# EAGLE design tm7_revB (EAGLE 9.6.2)
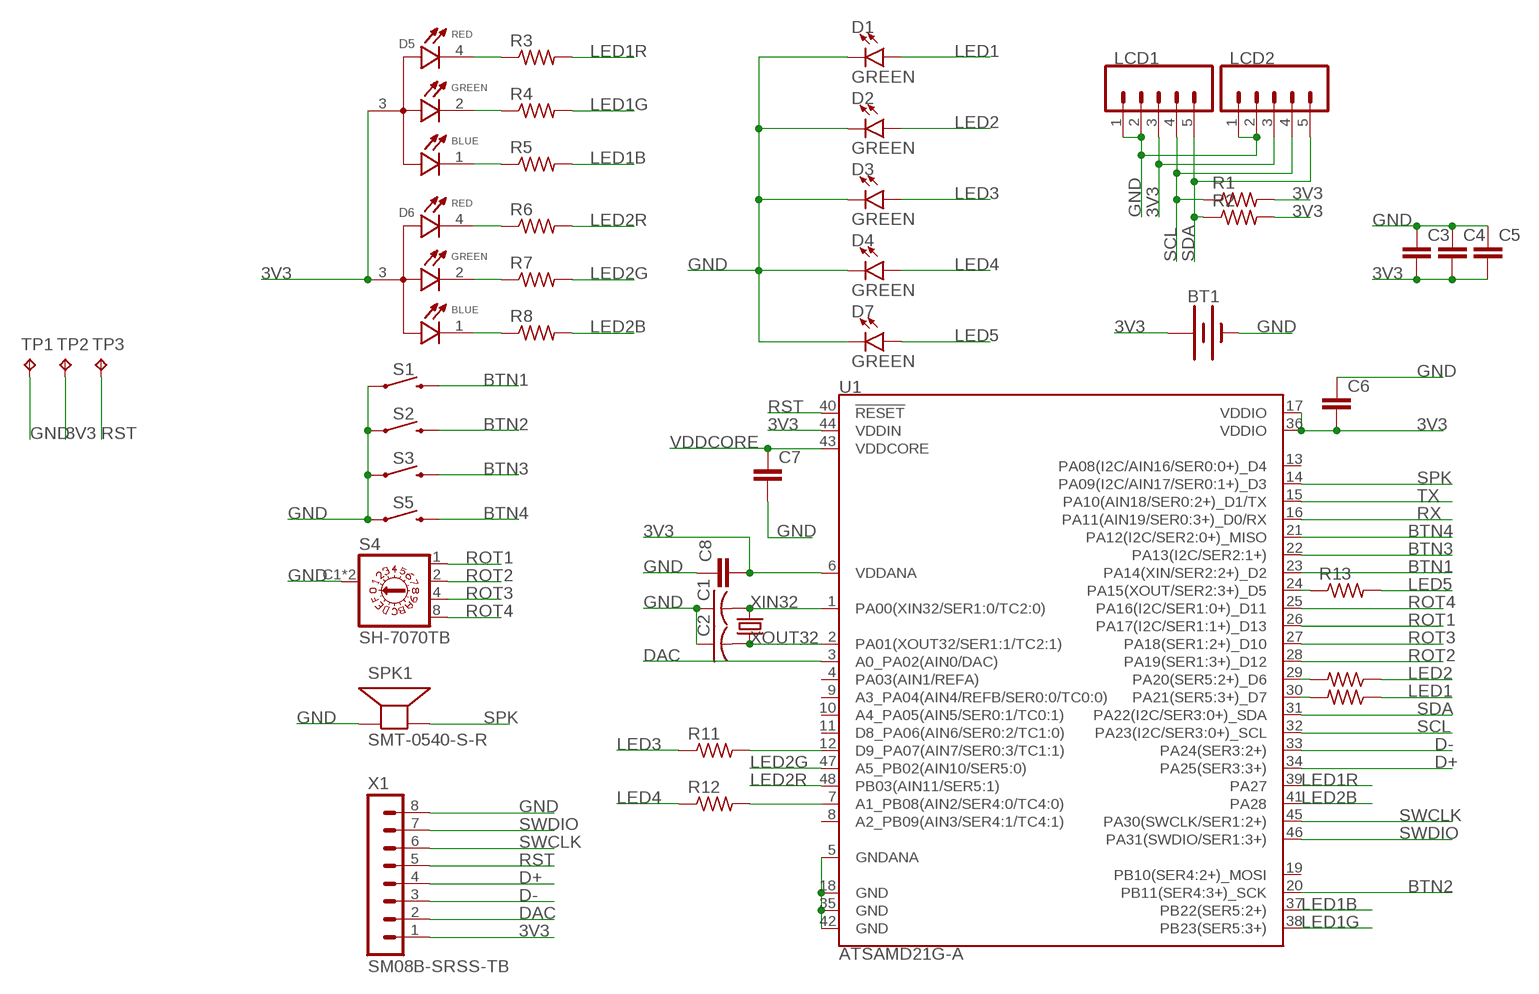
[diagram p0: schematic, sheet 1]

## Parts
BT1  BATTERY-20MM_SMD_4LEGS_OVERPASTE_INNER  [BATTCON_20MM_4LEGS_OVERPASTE_INNER]
C1  C-USC0603  [C0603]
C2  C-USC0603  [C0603]
C3  C-EUC0603  [C0603]
C4  C-EUC0603  [C0603]
C5  C-EUC0603  [C0603]
C6  C-EUC0603  [C0603]
C7  C-EUC0603  [C0603]
C8  C-EUC0603  [C0603]
D1  GREEN  LED-GREEN1206  [LED-1206]
D2  GREEN  LED-GREEN1206  [LED-1206]
D3  GREEN  LED-GREEN1206  [LED-1206]
D4  GREEN  LED-GREEN1206  [LED-1206]
D5  EAST1616RGBA3  [LED_EAST1616RGBA3]
D6  EAST1616RGBA3  [LED_EAST1616RGBA3]
D7  GREEN  LED-GREEN1206  [LED-1206]
LCD1  CONN_05VERT_FEMALE_HEADER  [1X05_SMD_VERTICAL_COMBO]
LCD2  CONN_05VERT_FEMALE_HEADER  [1X05_SMD_VERTICAL_COMBO]
R1  R-US_R0603  [R0603]
R2  R-US_R0603  [R0603]
R3  R-US_R0603  [R0603]
R4  R-US_R0603  [R0603]
R5  R-US_R0603  [R0603]
R6  R-US_R0603  [R0603]
R7  R-US_R0603  [R0603]
R8  R-US_R0603  [R0603]
R9  R-US_R0603  [R0603]
R10  R-US_R0603  [R0603]
R11  R-US_R0603  [R0603]
R12  R-US_R0603  [R0603]
R13  R-US_R0603  [R0603]
S1  MOMENTARY-SWITCH-SPST-SMD-6.0X3.5MM  [TACTILE_SWITCH_SMD_6.0X3.5MM]
S2  MOMENTARY-SWITCH-SPST-SMD-6.0X3.5MM  [TACTILE_SWITCH_SMD_6.0X3.5MM]
S3  MOMENTARY-SWITCH-SPST-SMD-6.0X3.5MM  [TACTILE_SWITCH_SMD_6.0X3.5MM]
S4  SH-7070TB  [SH-7070B]
S5  MOMENTARY-SWITCH-SPST-SMD-6.0X3.5MM  [TACTILE_SWITCH_SMD_6.0X3.5MM]
SPK1  SMT-0540-S-R  [SMT-0540-S-R]
TP1  TPTP12R  [TP12R]
TP2  TPTP12R  [TP12R]
TP3  TPTP12R  [TP12R]
U1  ATSAMD21G-A  [TQFP-48]
X1  SM08B-SRSS-TB  [SM08B-SRSS-TB]
Y1  32.768kHz  CRYSTAL-32.768KHZSMD-3.2X1.5  [CRYSTAL-SMD-3.2X1.5MM]

## Nets
3V3: BT1.1(+) C3.2 C4.2 C5.2 C6.2 C8.2 D5.3(A) D6.3(A) LCD1.3 LCD2.3 R1.2 R2.2 TP2.TP U1.6(VDDANA) U1.17(VDDIO) U1.36(VDDIO) U1.44(VDDIN) X1.1
BTN1: S1.2 U1.23(PA14(XIN/SER2:2+)_D2)
BTN2: S2.2 U1.20(PB11(SER4:3+)_SCK)
BTN3: S3.2 U1.22(PA13(I2C/SER2:1+))
BTN4: S5.2 U1.21(PA12(I2C/SER2:0+)_MISO)
D+: U1.34(PA25(SER3:3+)) X1.4
D-: U1.33(PA24(SER3:2+)) X1.3
DAC: U1.3(A0_PA02(AIN0/DAC)) X1.2
GND: BT1.2(-) C1.1 C2.1 C3.1 C4.1 C5.1 C6.1 C7.2 C8.1 D1.C D2.C D3.C D4.C D7.C LCD1.1 LCD1.2 LCD2.1 LCD2.2 S1.1 S2.1 S3.1 S4.C1(C) S4.C2(C) S5.1 SPK1.-(+) TP1.TP U1.5(GNDANA) U1.18(GND) U1.35(GND) U1.42(GND) X1.8
LED1: D1.A R9.1
LED1B: R5.2 U1.37(PB22(SER5:2+))
LED1G: R4.2 U1.38(PB23(SER5:3+))
LED1R: R3.2 U1.39(PA27)
LED2: D2.A R10.1
LED2B: R8.2 U1.41(PA28)
LED2G: R7.2 U1.47(A5_PB02(AIN10/SER5:0))
LED2R: R6.2 U1.48(PB03(AIN11/SER5:1))
LED3: D3.A R11.1
LED4: D4.A R12.1
LED5: D7.A R13.2
N$1: R12.2 U1.7(A1_PB08(AIN2/SER4:0/TC4:0))
N$2: R11.2 U1.12(D9_PA07(AIN7/SER0:3/TC1:1))
N$3: R9.2 U1.30(PA21(SER5:3+)_D7)
N$4: R10.2 U1.29(PA20(SER5:2+)_D6)
N$5: D5.4(R_C) R3.1
N$6: D5.2(G_C) R4.1
N$7: D5.1(B_C) R5.1
N$8: D6.4(R_C) R6.1
N$9: D6.2(G_C) R7.1
N$10: D6.1(B_C) R8.1
N$11: R13.1 U1.24(PA15(XOUT/SER2:3+)_D5)
ROT1: S4.1 U1.26(PA17(I2C/SER1:1+)_D13)
ROT2: S4.2 U1.28(PA19(SER1:3+)_D12)
ROT3: S4.4 U1.27(PA18(SER1:2+)_D10)
ROT4: S4.8 U1.25(PA16(I2C/SER1:0+)_D11)
RST: TP3.TP U1.40(!RESET!) X1.5
RX: U1.16(PA11(AIN19/SER0:3+)_D0/RX)
SCL: LCD1.4 LCD2.4 R1.1 U1.32(PA23(I2C/SER3:0+)_SCL)
SDA: LCD1.5 LCD2.5 R2.1 U1.31(PA22(I2C/SER3:0+)_SDA)
SPK: SPK1.+(-) U1.14(PA09(I2C/AIN17/SER0:1+)_D3)
SWCLK: U1.45(PA30(SWCLK/SER1:2+)) X1.6
SWDIO: U1.46(PA31(SWDIO/SER1:3+)) X1.7
TX: U1.15(PA10(AIN18/SER0:2+)_D1/TX)
VDDCORE: C7.1 U1.43(VDDCORE)
XIN32: C1.2 U1.1(PA00(XIN32/SER1:0/TC2:0)) Y1.P$2
XOUT32: C2.2 U1.2(PA01(XOUT32/SER1:1/TC2:1)) Y1.P$1
Unconnected: U1.4(PA03(AIN1/REFA)) U1.8(A2_PB09(AIN3/SER4:1/TC4:1)) U1.9(A3_PA04(AIN4/REFB/SER0:0/TC0:0)) U1.10(A4_PA05(AIN5/SER0:1/TC0:1)) U1.11(D8_PA06(AIN6/SER0:2/TC1:0)) U1.13(PA08(I2C/AIN16/SER0:0+)_D4) U1.19(PB10(SER4:2+)_MOSI)

## Library data of the parts
BT1 = SparkFun-Batteries:BATTERY: Battery - Single Cell A variety of battery chemistries, sizes, and footprints. Device List: 20MM_PTH - Coin Cell Battery Holder - 20mm (PTH) <https://www.sparkfun.com/products/783> 20MM_PTH_KIT- Coin Cell battery Holder - 20 mm (PTH) <http://www.sparkfun.com/products/783>kit version with special mask 6.8MM_PTH - Coin Cell Battery Holder - 6.8MM(SMD) <https://www.digikey.com/product-detail/en/seiko-instruments/MS621FE-FL11E/728-1057-ND/1889208?WT.srch=1&gclid=CNOQ5a6LzdQCFZS2wAodXCkE0g> 12MM_SMD - Coin Cell Battery Holder - 12mm (SMD) <https://www.sparkfun.com/products/10592> 12MM_PTH - Coin Cell Battery Holder - 12mm (PTH) <https://www.sparkfun.com/products/7948> 20MM_SMD - 20mm Coin Cell Battery Holder (SMD) (2 legs) Used on the Big Time Watch Kit <https://www.sparkfun.com/products/11734> 20MM_SMD_4LEGS - Coin Cell Battery Holder - 20mm (SMD) <https://www.sparkfun.com/products/11892> 20MM_SMD_4LEGS_OVERPASTE - Coin Cell Battery Holder - 20mm (SMD) <https://www.sparkfun.com/products/11892> (Over-paste on the legs) 24.5MM_PTH - Coin Cell Battery Holder - 24.5mm (PTH) <https://www.sparkfun.com/products/8863> 9V - 9V Battery Holder - PC Mount Used on the SparkFun SparkPunk Sound Kit <https://www.sparkfun.com/products/11177> and SparkFun SparkPunk Sequencer Kit <https://www.sparkfun.com/products/12707> 18650 - Battery Holder - 18650 (PTH) <https://www.sparkfun.com/products/13113> AA - Battery Holder - 1xAA (PTH) <https://www.sparkfun.com/products/7949> AAA - Battery Holder - 1xAAA (PTH) <https://www.sparkfun.com/products/12718> AA_KIT - Battery Holder - 1xAA (PTH) <https://www.sparkfun.com/products/7949> Special kit package - pads only have exposed copper on one side of the board. AAA_KIT - Battery Holder - 1xAAA (PTH) <https://www.sparkfun.com/products/12718> Special kit package - pads only have exposed copper on one side of the board.
C1 C2 = adafruit:C-US: CAPACITOR, American symbol
C3-C8 = rcl:C-EU: CAPACITOR, European symbol; SPICEPREFIX: C
D1-D4 D7 = SparkFun-LED:LED-GREEN: Green SMD LED Used in manufacturing of various products at SparkFun Packages: 0603 - SMD 0603 package [Product Link] <http://www.futureelectronics.com/en/technologies/semiconductors/optoelectronics/leds/Pages/9894312-LTST-C190GKT.aspx?CrossPart=HSMG-C190&IM=0> LilyPad 1206 - SMD1206 LilyPad package [Product Link] <http://www.futureelectronics.com/en/Technologies/Product.aspx?ProductID=IN150NGHARVATEKCORPORATION2049943&IM=0> 1206 - SMD1206 package [Product Link] <http://www.futureelectronics.com/en/technologies/semiconductors/optoelectronics/leds/Pages/8315665-LTST-C150KGKT.aspx?IM=0> 1206 Bottom Mount -SMD 1206 Bottom Mount [Product Link] <http://www.digikey.com/product-detail/en/lite-on-inc/LTST-C230KGKT/160-1456-1-ND/386854> SparkFun Products: Pro Mini 328 -5V <https://www.sparkfun.com/products/821> RedBoard <https://www.sparkfun.com/products/12757> MP3 Trigger <https://www.sparkfun.com/products/13720> Makey Makey <https://www.sparkfun.com/products/11076>; PROD_ID: DIO-00862
D5 D6 = EAST1616RGBA3:EAST1616RGBA3: Red, Green, Blue (RGB) LED Indication - Discrete 1.95V Red, 2.8V Green, 2.8V Blue 0606 (1616 Metric) Check availability <https://pricing.snapeda.com/parts/EAST1616RGBA3/Everlight%20Electronics/view-part?ref=eda>; AVAILABILITY: In Stock; DESCRIPTION: Red, Green, Blue (RGB) - LED Indication - Discrete 1.95V Red, 2.8V Green, 2.8V Blue 0606 (1616 Metric); MF: Everlight Electronics; MP: EAST1616RGBA3; PACKAGE: 0606 Everlight; PRICE: None; PURCHASE-URL: https://pricing.snapeda.com/search/part/EAST1616RGBA3/?ref=eda
LCD1 LCD2 = SparkFun-Connectors:CONN_05: Multi connection point. Often used as Generic Header-pin footprint for 0.1 inch spaced/style header connections On any of the 0.1 inch spaced packages, you can populate with these: Break Away Headers - Straight <https://www.sparkfun.com/products/116> (PRT-00116) Break Away Male Headers - Right Angle <https://www.sparkfun.com/products/553> (PRT-00553) Female Headers <https://www.sparkfun.com/products/115> (PRT-00115) Break Away Headers - Machine Pin <https://www.sparkfun.com/products/117> (PRT-00117) Break Away Female Headers - Swiss Machine Pin <https://www.sparkfun.com/products/743> (PRT-00743) For SCREWTERMINALS and SPRING TERMINALS visit here: Screw Terimnals on SparkFun.com <https://www.sparkfun.com/search/results?term=Screw+Terminals> (5mm/3.5mm/2.54mm spacing) This device is also useful as a general connection point to wire up your design to another part of your project. Our various solder wires solder well into these plated through hole pads. Hook-Up Wire - Assortment (Stranded, 22 AWG) <https://www.sparkfun.com/products/11375> (PRT-11375) Hook-Up Wire - Assortment (Solid Core, 22 AWG) <https://www.sparkfun.com/products/11367> (PRT-11367) View the entire wire category on our website here <https://www.sparkfun.com/categories/141> Special notes: Molex polarized connector foot print use with SKU : PRT-08231 with associated crimp pins and housings. 1MM SMD Version SKU: PRT-10208; PROD_ID: CONN-15262
R1-R13 = rcl:R-US_: RESISTOR, American symbol; SPICEPREFIX: R
S1-S3 S5 = SparkFun-Switches:MOMENTARY-SWITCH-SPST: Momentary Switch (Pushbutton) - SPST Normally-open (NO) SPST momentary switches (buttons, pushbuttons). Variants PTH-12MM - 12mm square, through-hole Momentary Pushbutton Switch - 12mm Square <https://www.sparkfun.com/products/9190> (COM-09190) PTH-6.0MM, PTH-6.0MM-KIT - 6.0mm square, through-hole Mini Pushbutton Switch <https://www.sparkfun.com/products/97> (COM-00097) KIT package intended for soldering kit's - only one side of pads' copper is exposed. PTH-RIGHT-ANGLE-KIT - Right-angle, through-hole Right Angle Tactile Button <https://www.sparkfun.com/products/10791> - Used on SparkFun BigTime Watch Kit <https://www.sparkfun.com/products/11734> SMD-12MM - 12mm square, surface-mount Tactile Button - SMD (12mm) <https://www.sparkfun.com/products/12993> (COM-12993) Used on SparkFun PicoBoard <https://www.sparkfun.com/products/11888> SMD-4.5MM - 4.5mm Square Trackball Switch Used on SparkFun Blackberry Trackballer Breakout <https://www.sparkfun.com/products/13169> SMD-4.6MMX2.8MM - 4.60mm x 2.80mm, surface mount Used on SparkFun Pro Micro - RP2040 <https://www.sparkfun.com/products/17717> SMD-5.2MM, SMD-5.2-REDUNDANT - 5.2mm square, surface-mount Mini Pushbutton Switch - SMD <https://www.sparkfun.com/products/8720> (COM-08720) Used on Arduino Pro Mini <https://www.sparkfun.com/products/11114> REDUNDANT package connects both switch circuits together SMD-6.0X3.5MM - 6.0 x 3.5mm, surface mount Momentary Reset Switch SMD <https://www.sparkfun.com/products/8229> (COM-08229) SMD-6.2MM-TALL - 6.2mm square, surface mount Tactile Button - SMD (6mm) <https://www.sparkfun.com/products/12992> Used on SparkFun Digital Sandbox <https://www.sparkfun.com/products/12651> SMD-RIGHT-ANGLE - Right-angle, surface mount Used on SparkFun Block for Intel® Edison - Arduino <https://www.sparkfun.com/products/13036>; PROD_ID: SWCH-14278; SF_SKU: COM-08229
S4 = SH-7070TB:SH-7070TB: ROTARY CODED HEX SWITCH Check availability <https://pricing.snapeda.com/parts/SH-7070TB/Nidec%20Copal/view-part?ref=eda>; AVAILABILITY: In Stock; DESCRIPTION: Dip Switch Hexadecimal Complement 16 Position Surface Mount Rotary for Tool Actuator 100mA 5VDC; MF: Nidec Copal; MP: SH-7070TB; PACKAGE: None; PRICE: None; PURCHASE-URL: https://pricing.snapeda.com/search/part/SH-7070TB/?ref=eda
SPK1 = SMT-0540-S-R:SMT-0540-S-R: SMT-0549-S-R Small surface-mount magnetic buzzer Check availability <https://pricing.snapeda.com/parts/SMT-0540-S-R/PUI/view-part?ref=eda>; AVAILABILITY: In Stock; DESCRIPTION: SURFACE MOUNT TRANSDUCER 3V0-P 100MA; MF: PUI; MP: SMT-0540-S-R; PACKAGE: None; PRICE: None; PURCHASE-URL: https://pricing.snapeda.com/search/part/SMT-0540-S-R/?ref=eda
TP1-TP3 = testpad:TP: Test pad
U1 = SparkFun-IC-Microcontroller:ATSAMD21G: Atmel SAMD21G SMART ARM-Based Microcontroller The Atmel ® | SMART ™ SAM D21 is a series of low-power microcontrollers using the 32-bit ARM ® Cortex ® -M0+ processor, and ranging from 32- to 64-pins with up to 256KB Flash and 32KB of SRAM. The SAM D21 devices operate at a maximum frequency of 48MHz and reach 2.46 CoreMark/MHz. They are designed for simple and intuitive migration with identical peripheral modules, hex compatible code, identical linear address map and pin compatible migration paths between all devices in the product series. All devices include intelligent and flexible peripherals, Atmel Event System for inter-peripheral signaling, and support for capacitive touch button, slider and wheel user interfaces. Datasheet <https://cdn.sparkfun.com/datasheets/Dev/Arduino/Boards/Atmel-42181-SAM-D21_Datasheet.pdf> SparkFun Products SparkFun SAMD21 Mini Breakout <https://www.sparkfun.com/products/13664> (DEV-13664) SparkFun SAMD21 Dev Breakout <https://www.sparkfun.com/products/13672> (DEV-13672) (DEV-14926); PROD_ID: IC-13064
X1 = con-JST:SM08B-SRSS: JST SH series header 1.00mm pitch disconnectable crimp style connectors, horizontal (side entry type), 8 pins
Y1 = SparkFun-Clocks:CRYSTAL-32.768KHZ: 32.768kHz Crystal Frequency: 32.768kHz Frequency Stability: ±20ppm Load Capacitance: 12.5pF (PTH-2X6 & SMD-3.2X1.5), 6pF (SMD-2X6) SparkFun Products: SparkFun BigTime Watch Kit <https://www.sparkfun.com/products/11734> SparkFun nRF52832 Breakout <https://www.sparkfun.com/products/13990> SparkFun Real Time Clock Module <https://www.sparkfun.com/products/12708>; PROD_ID: XTAL-13062

## Board
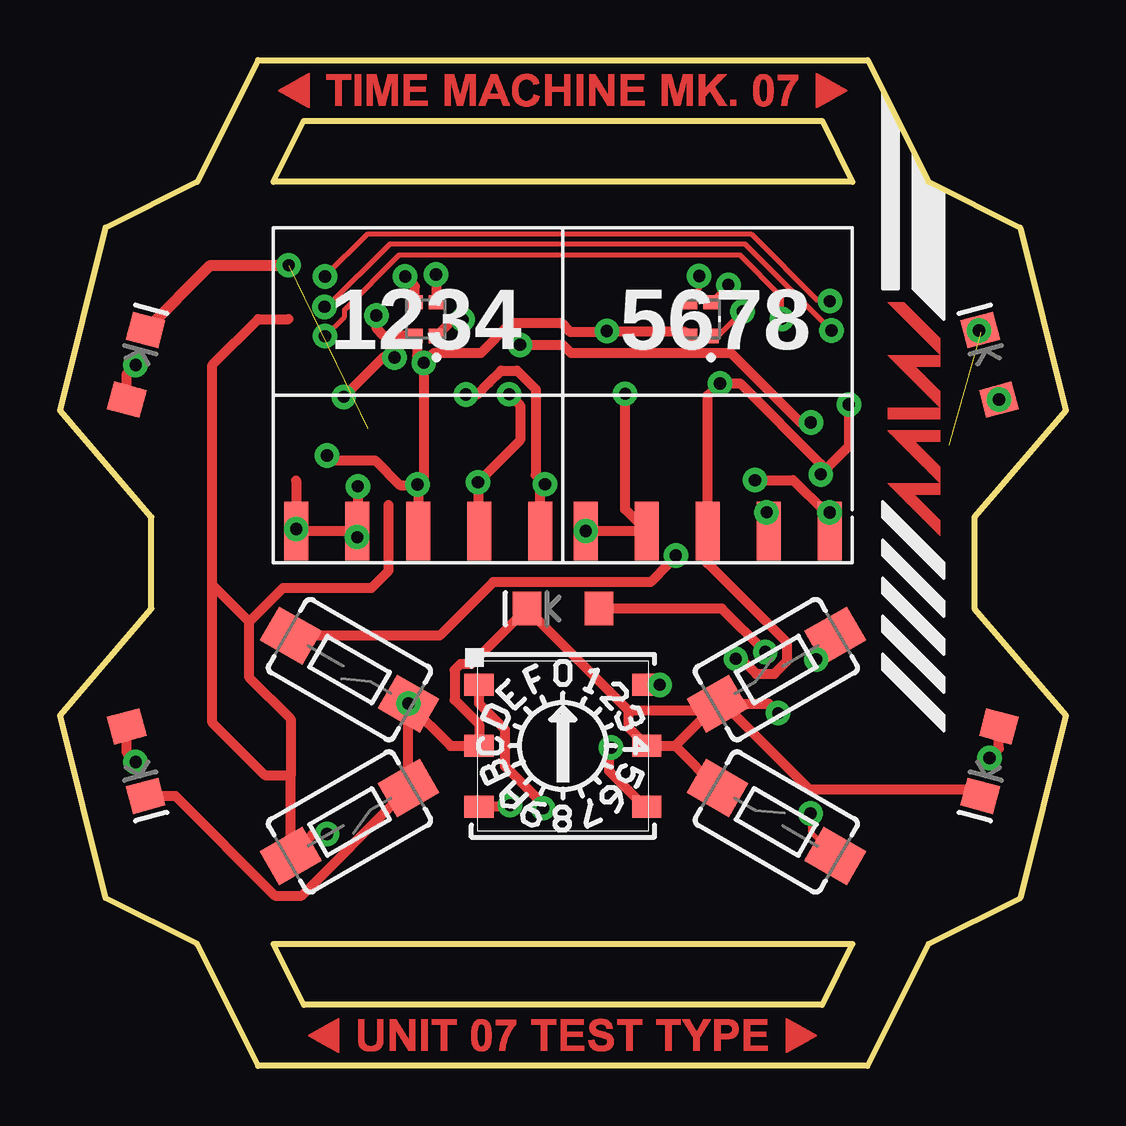
[diagram p1: board, top side]
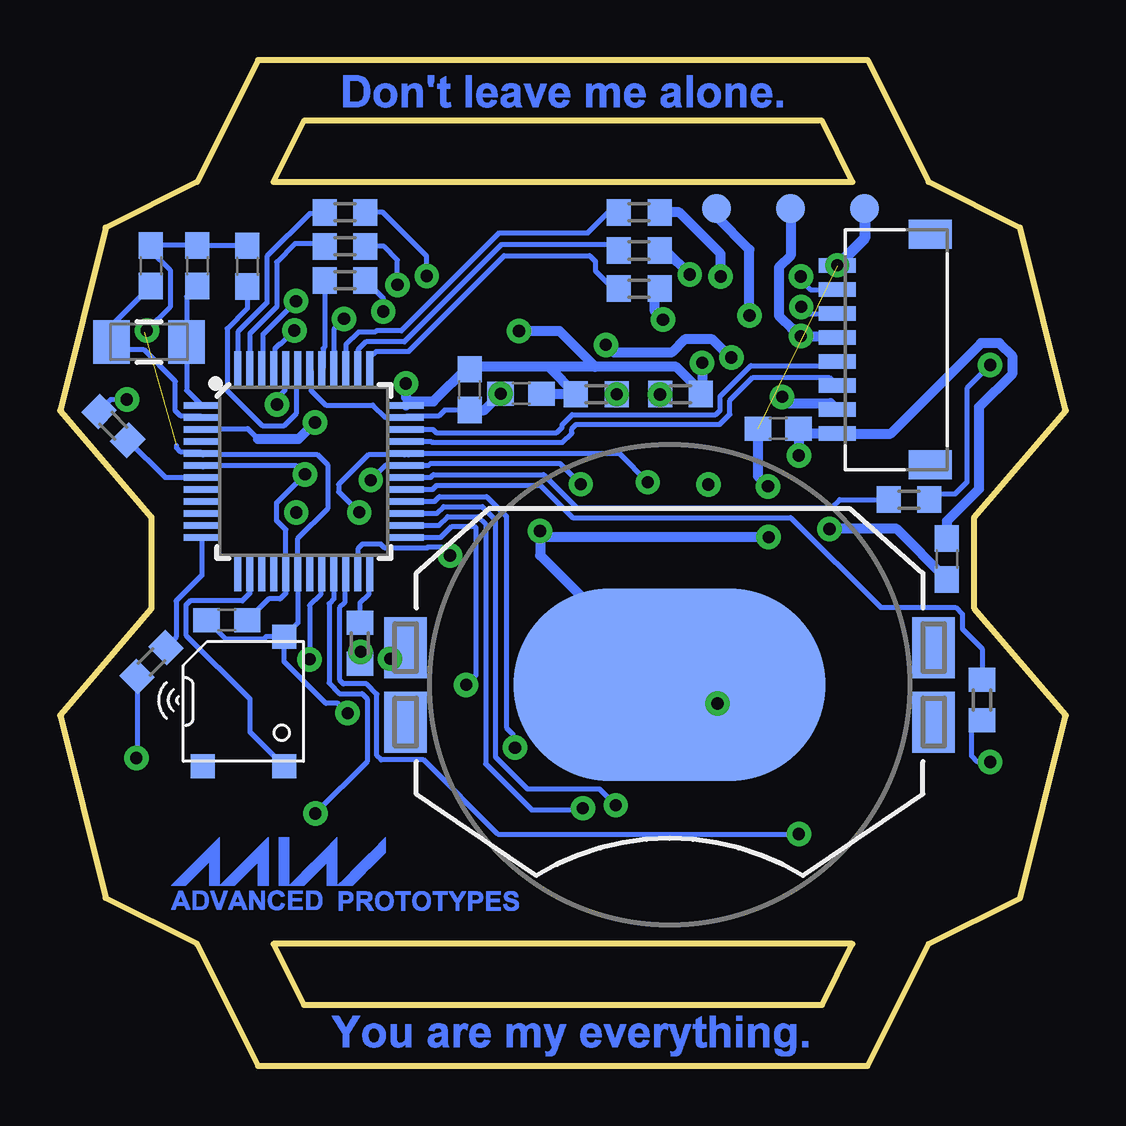
[diagram p2: board, bottom side, seen from below]

Size 41.91 x 41.91 mm. Coordinates in mm from the lower left corner, seen from the top.
Outline: 33.66,0 8.25,0 5.71,5.08 1.9,6.98 0,14.61 3.81,19.05 3.81,22.86 0,27.3 1.9,34.92 5.71,36.83 8.25,41.91 33.66,41.91 36.19,36.83 40,34.92 41.91,27.3 38.1,22.86 38.1,19.05 41.91,14.61 40,6.98 36.19,5.08 33.66,0
Outline: 8.89,36.83 10.16,39.37 31.75,39.37 33.02,36.83 8.89,36.83
Outline: 33.02,5.08 31.75,2.54 10.16,2.54 8.89,5.08 33.02,5.08
Copper layers (1*16): Top 0.035mm / dielectric 1.5mm / Bottom 0.035mm
Design rules "SparkFun": minimum track width 8mil, minimum drill 20mil, track to track 8mil, track to pad 8mil, pad to pad 8mil, via to via 8mil, smd to smd 8mil, copper to edge 10mil, drill to drill 8mil, minimum pad ring 12mil, minimum via ring 10mil, stop-mask expansion 4mil, vias tented up to drill 25mil, thermal gap 10mil

### Footprints (pad centres in the part's own frame; a part is rotated, then mirrored left to right if it is on the bottom)
BATTCON_20MM_4LEGS_OVERPASTE_INNER = smd 1.778 x 2.54: 1 -11,1.55; 3 11,1.55; P$1 -11,-1.55; P$2 11,-1.55 | smd 13 x 8: 2 0,0
C0603 = smd 1.1 x 1: 1 -0.85,0; 2 0.85,0
LED-1206 = smd 1.2 x 1.4: A -1.5,0; C 1.5,0
LED_EAST1616RGBA3 = smd 0.6 x 0.65: 1 0.7,0.45; 2 -0.7,0.45; 3 0.7,-0.45; 4 -0.7,-0.45
1X05_SMD_VERTICAL_COMBO = smd 1 x 2.438: 1 0,1.65; 2 2.54,1.65; 3 5.08,1.65; 4 7.62,1.652; 5 10.16,1.65
R0603 = smd 1 x 1.1: 1 -0.85,0; 2 0.85,0
TACTILE_SWITCH_SMD_6.0X3.5MM = smd 2.032 x 1.626: 1 -2.833,0; 2 2.833,0
SH-7070B = smd 1.219 x 0.914: 1 -2.223,3.81; 2 4.763,-1.27; 4 -2.223,-1.27; 8 4.763,3.81; C1 -2.223,1.27; C2 4.763,1.27
SMT-0540-S-R = smd 1 x 1: + 1.7,-2.7; - 1.7,2.7; M -1.7,-2.7
TP12R = smd 1.2 x 1.2: TP 0,0
TQFP-48 = smd 1.5 x 0.28: 1 -4.25,2.75; 2 -4.25,2.25; 3 -4.25,1.75; 4 -4.25,1.25; 5 -4.25,0.75; 6 -4.25,0.25; 7 -4.25,-0.25; 8 -4.25,-0.75; 9 -4.25,-1.25; 10 -4.25,-1.75; 11 -4.25,-2.25; 12 -4.25,-2.75; 25 4.25,-2.75; 26 4.25,-2.25; 27 4.25,-1.75; 28 4.25,-1.25; 29 4.25,-0.75; 30 4.25,-0.25; 31 4.25,0.25; 32 4.25,0.75; 33 4.25,1.25; 34 4.25,1.75; 35 4.25,2.25; 36 4.25,2.75 | smd 0.28 x 1.5: 13 -2.75,-4.25; 14 -2.25,-4.25; 15 -1.75,-4.25; 16 -1.25,-4.25; 17 -0.75,-4.25; 18 -0.25,-4.25; 19 0.25,-4.25; 20 0.75,-4.25; 21 1.25,-4.25; 22 1.75,-4.25; 23 2.25,-4.25; 24 2.75,-4.25; 37 2.75,4.25; 38 2.25,4.25; 39 1.75,4.25; 40 1.25,4.25; 41 0.75,4.25; 42 0.25,4.25; 43 -0.25,4.25; 44 -0.75,4.25; 45 -1.25,4.25; 46 -1.75,4.25; 47 -2.25,4.25; 48 -2.75,4.25
SM08B-SRSS-TB = smd 0.6 x 1.55: 1 3.5,0; 2 2.5,0; 3 1.5,0; 4 0.5,0; 5 -0.5,0; 6 -1.5,0; 7 -2.5,0; 8 -3.5,0 | smd 1.2 x 1.8: M1 4.8,3.875; M2 -4.8,3.875
CRYSTAL-SMD-3.2X1.5MM = smd 1.524 x 1.8: P$1 -1.567,0; P$2 1.567,0

### Placement (x,y rotation side)
BT1  16.51,15.88 0 bottom
C1  36.19,33.34 270 bottom
C2  38.13,33.34 270 bottom
C3  4.95,21.12 90 bottom
C4  24.84,28.17 90 bottom
C5  22.7,28 0 bottom
C6  11.98,26.55 0 bottom
C7  34.1,33.32 90 bottom
C8  34.96,18.57 0 bottom
D1  3.18,29.21 75 top
D2  3.18,12.7 285 top
D3  38.73,12.7 255 top
D4  38.73,29.21 105 top
D5  15.24,31.12 270 top
D6  26.67,31.12 270 top
D7  20.96,19.05 180 top
LCD1  9.84,20.64 0 top
LCD2  21.91,20.64 0 top
R1  19.56,27.98 180 bottom
R2  16.06,27.99 0 bottom
R3  17.78,35.56 180 bottom
R4  17.78,33.97 180 bottom
R5  17.78,32.38 180 bottom
R6  30.04,35.56 180 bottom
R7  30.04,34.14 180 bottom
R8  30.04,32.73 180 bottom
R9  6.53,23.59 180 bottom
R10  3.49,15.24 90 bottom
R11  38.1,16.83 45 bottom
R12  39.69,26.67 315 bottom
R13  29.42,17.61 270 bottom
S1  12.06,16.51 150 top
S2  29.85,16.51 30 top
S3  12.06,10.16 210 top
S4  19.68,12.07 0 top
S5  29.85,10.16 330 top
SPK1  34.27,15.18 0 bottom
TP1  8.38,35.72 180 bottom
TP2  14.55,35.72 180 bottom
TP3  11.47,35.72 180 bottom
U1  31.75,24.77 0 bottom
X1  9.52,29.84 270 bottom
Y1  38.2,30.16 0 bottom

### Tracks (layer width: path | path; a pad name or v marks a point on that pad's centre or on a via)
3V3  (via drill 0.51)
  Top 0.203: v14.9,24.23 14.92,24.2
  Top 0.406: LCD1.3 14.92,24.2 14.17,24.2 13.13,25.23 11.32,25.23 v11.12,25.43 | v15.15,29.29 14.88,29.57 14.88,30.33 D5.3 14.33,30.41 14.31,30.43 13.5,30.43 13.18,30.75 v13.18,31.26 | v15.15,29.29 15.15,24.48 v14.9,24.23 | v32.87,27.55 32.87,25.82 v31.7,24.65 31.7,25.07 28.34,28.43 v27.5,28.43 26.99,27.92 LCD2.3 26.99,20.94 30.3,17.63 30.3,16.87 29.76,16.33 29.01,16.33 28.37,16.96 v28.15,16.96 | D6.3 26.05,30.59 22.82,30.59 | 22.82,30.59 v22.78,30.62 | v15.15,29.29 15.57,29.71 17.54,29.71 18.79,30.95 20.9,30.95 21.27,30.59 22.82,30.59
  Bottom 0.203: C8.2 33.22,19.46 32.73,19.46 32.5,19.69 U1.17 32.5,22.34 32.88,22.72 32.88,23.47 v31.7,24.65 32.07,25.02 U1.6 35.94,24.96 | 24.88,29.16 24.88,28.99 C4.2 24.74,29.13 | 15.15,28.05 R2.2 | U1.44 32.54,28.98 32.54,28.16 32.87,27.83 v32.87,27.55 | v27.5,28.43 | 4.64,22.29 C3.2 | BT1.1 27.69,17.43 v28.15,16.96
  Bottom 0.406: 24.88,29.16 26.35,27.69 27.33,27.69 | v15.15,29.29 15.15,28.05 16.23,29.13 19.61,29.13 | 19.61,29.13 21.56,29.13 | 21.56,29.13 R1.2 21.83,27.98 C5.2 | 21.56,29.13 24.74,29.13 | v27.5,28.43 27.5,27.86 27.33,27.69 | U1.36 27.33,27.69 | C3.2 4.95,22.7 3.62,24.03 3.62,27.44 2.24,28.83 2.24,29.58 2.77,30.12 3.53,30.12 7.3,26.34 X1.1 10.93,26.34 C6.2 v11.13,25.44 v11.12,25.43 | v22.78,30.62 21.11,30.62 19.61,29.13 | v13.18,31.26 13.18,34 14.55,35.38 TP2.TP
BTN1  (via drill 0.51)
  Top 0.406: v25.66,21.26 25.35,20.96 25.35,20.9 24.61,20.16 18.05,20.16 15.82,17.93 S1.2
  Bottom 0.203: v25.66,21.26 26.01,21.61 26.58,21.61 26.62,21.57 28.38,21.57 28.54,21.73 29.31,21.73 29.5,21.54 U1.23
BTN2  (via drill 0.51)
  Top 0.203: v31.51,16.93 31.51,17.14 S2.2
  Bottom 0.203: U1.20 31.05,20.46 31.05,19.64 31.51,19.18 v31.51,16.93
BTN3  (via drill 0.51)
  Top 0.203: 10.21,8.74 S3.2
  Top 0.406: 9.61,12.07 9.61,14.46 7.89,16.18 7.89,18.51 | 13.7,23.37 13.7,20.63 12.98,19.92 9.3,19.92 7.89,18.51 | v11.12,9.66 10.53,9.66 S3.2 9.61,12.07 | 7.89,18.51 6.35,20.05 | 6.35,20.05 6.35,29.21 8.25,31.12 9.52,31.12 | 6.35,20.05 6.35,14.3 8.54,12.11 9.57,12.11 9.61,12.07
  Bottom 0.203: U1.22 30.05,20.46 30.05,19.3 30.27,19.09 30.27,16.09 30.1,15.92 29.13,15.92 28.7,15.49 28.7,12.93 28.53,12.75 26.76,12.75 23.67,9.66 v11.12,9.66
BTN4  (via drill 0.51)
  Top 0.203: v31.27,10.52 31.27,9.77 S5.2
  Bottom 0.203: U1.21 30.5,19.46 30.7,19.26 30.7,15.94 30.27,15.51 29.32,15.51 29.11,15.3 29.11,12.68 v31.27,10.52
D+
  Bottom 0.203: U1.34 26.37,26.52 26.24,26.38 21.21,26.38 20.99,26.61 20.99,26.71 20.57,27.13 14.59,27.13 14.4,27.31 14.4,27.9 13.13,29.17 9.7,29.17 X1.4
D-
  Bottom 0.203: U1.33 26.44,26.02 26.41,25.98 20.98,25.98 20.59,26.37 20.59,26.54 20.4,26.72 14.42,26.72 14,27.15 14,27.73 13.04,28.69 9.87,28.69 X1.3
DAC  (via drill 0.51)
  Top 0.406: v11.82,27.88 13.46,29.52 v13.93,29.52 | v31.29,26.8 30.86,26.8 27.95,29.71 21.29,29.71 20.95,30.04 v19.17,30.04
  Bottom 0.203: U1.3 35.97,26.55 34.09,26.55 33.67,26.12
  Bottom 0.406: X1.2 9.8,27.62 11.56,27.62 v11.82,27.88 | v13.93,29.52 13.97,29.52 14.73,30.27 15.88,30.27 16.41,29.74 18.87,29.74 v19.17,30.04 | 33.67,26.12 31.97,26.12 v31.29,26.8
GND  (via drill 0.51)  (2 unrouted)
  Top 0.203: D4.C 38.36,30.64 | 38.38,30.57 38.38,30.63 38.36,30.64 | 24.84,22.29 LCD2.2 | S1.1 14.6,15.18 | v38.29,30.64 38.36,30.64 | 12.38,21.94 v12.38,22.03 12.38,22.17 LCD1.2 12.58,22.49
  Top 0.406: LCD2.1 LCD2.2 23.55,23.19 C5.1 | D3.C 38.09,11.51 31.23,11.51 27.65,15.09 S2.1 | S2.1 29.53,15.09 v29.92,14.7 | 25.63,13.34 S4.C2 23.7,14.08 23.7,14.8 | 25.63,13.34 S2.1 | 25.63,13.34 S5.1 | 23.7,14.8 27.1,14.8 S2.1 | 23.7,14.8 D7.C 17.14,16.74 16.68,16.74 16.45,16.5 16.45,15.24 17.46,14.23 S4.C1 16.28,13.34 S1.1 S3.1 14.19,11.25 14.19,11.23 10.06,7.1 8.96,7.1 4.8,11.25 D2.C | LCD1.1 12.27,22.29 12.38,22.17 | v12.38,22.03 LCD1.2 12.41,22.32 v12.41,24.15 | 9.84,24.38 LCD1.1 | v9.84,22.37 LCD1.1
  Top 0.457: D1.C 6.26,33.36 v9.52,33.36
  Bottom 0.203: C1.1 36.33,34.19 | 36.33,34.19 C2.1 38.12,33.97 37.32,33.16 37.32,31.61 v38.29,30.64 | C5.1 | 24.75,27.24 C4.1 25.88,27.33 26.14,27.07 27.44,27.07 U1.35 28.36,27.02 28.87,27.53 30.83,27.53 31.44,28.14 31.44,28.96 U1.42 | SPK1.- 32,18.45 U1.18 32,21.98 30.74,23.24 30.74,25.02 31.18,25.46 35.94,25.46 U1.5 36.05,25.57 36.88,25.57 37.05,25.75 37.05,25.85 | SPK1.- 33.32,17.88 33.43,17.77 35,17.77 C8.1 | v29.92,14.7 30.33,15.1 30.83,15.1 32.57,16.84 SPK1.- | 15.37,17.02 BT1.2 | C7.2 36.31,34.17 36.33,34.19
  Bottom 0.406: C4.1 24.23,27.33 C5.1 | v12.38,22.03 21.65,22.03 LCD2.1 21.91,21.27 BT1.2 15.3,15.88 S1.1 | C6.1 12.83,24.57 v12.41,24.15 | C3.1 7.05,22.37 v9.84,22.37
  Bottom 0.457: TP1.TP 8.38,34.49 X1.8 v9.52,33.36
  other vias: 14.52,15.09 21.91,22.29 23.55,28
LED1  (via drill 0.51)
  Top 0.406: D1.A 2.79,28.84 v3.15,29.2
  Bottom 0.203: R9.1 5.45,23.82 4.62,23.82 4.13,24.32 4.13,28.23 v3.15,29.2
LED1B
  Bottom 0.203: U1.37 29,29.5 28.74,29.76 27.39,29.76 23.4,33.76 19.85,33.76 19.61,33.52 19.61,33.12 18.87,32.38 R5.2
LED1G
  Bottom 0.203: R4.2 18.89,34.23 23.5,34.23 27.56,30.17 29.17,30.17 29.5,29.84 U1.38
LED1R
  Bottom 0.203: R3.2 19.06,35.56 19.92,34.7 23.6,34.7 27.69,30.62 28.74,30.62 28.79,30.58 29.47,30.58 30,30.05 U1.39
LED2  (via drill 0.51)
  Top 0.406: v3.15,12.66 2.79,13.02 D2.A
  Bottom 0.203: v3.15,12.66 3.67,12.66 3.92,12.92 3.92,13.96 R10.1
LED2B
  Bottom 0.203: 31,32.61 R8.2 30.89,29.95 30.94,29.89 30.94,29.07 U1.41
LED2G
  Bottom 0.203: R7.2 31.01,34.27 32.11,34.27 32.89,33.49 32.89,31.62 34,30.51 U1.47
LED2R
  Bottom 0.203: R6.2 30.93,35.51 31.51,35.51 33.3,33.73 33.3,31.79 34.5,30.59 U1.48
LED3  (via drill 0.51)
  Top 0.203: 38.73,13.75 D3.A
  Top 0.406: v38.73,12.83 39.12,13.23 D3.A
  Bottom 0.203: R11.1 38.7,12.86 v38.73,12.83
LED4  (via drill 0.51)
  Bottom 0.203: D4.A 39.8,27.76 R12.1
  other vias: 39.12,27.76
LED5  (via drill 0.51)
  Top 0.406: v29.39,17.25 27.58,19.05 D7.A
  Bottom 0.203: R13.2 29.42,17.22 v29.39,17.25
N$1
  Bottom 0.203: R12.2 37.53,24.52 U1.7
N$2
  Bottom 0.203: R11.2 37.07,17.86 37.07,19.37 36,20.44 U1.12
N$3
  Bottom 0.203: 7.67,23.88 R9.2 9.43,23.59 9.77,23.25 20.38,23.25 21.76,24.63 26.36,24.63 26.47,24.52 U1.30
N$4
  Bottom 0.203: U1.29 26.39,24.02 26.21,24.19 21.89,24.19 20.55,22.84 11.47,22.84 7.72,19.1 4.59,19.1 4.32,18.82 4.32,18.2 3.49,17.38 R10.2
N$5  (via drill 0.51)
  Top 0.406: D5.4 14.79,32.48 v14.38,32.89
  Bottom 0.406: v14.38,32.89 14.38,33.83 16.11,35.56 R3.1
N$6  (via drill 0.51)
  Top 0.203: D5.2 15.67,31.84
  Top 0.406: v15.67,32.98 15.67,31.84
  Bottom 0.406: R4.1 16.67,33.97 v15.67,32.98
N$7  (via drill 0.51)
  Top 0.406: D5.1 16.36,31.09 v16.78,31.09
  Bottom 0.203: 17.13,32.19 R5.1
  Bottom 0.406: v16.78,31.09 17.13,31.43 17.13,32.19
N$8  (via drill 0.51)
  Top 0.203: v26.63,32.91 26.63,32.38 26.49,32.24 26.49,32.09 D6.4
  Bottom 0.203: 26.63,33.15 v26.63,32.91 26.63,33.73 28.45,35.56 R6.1
N$9  (via drill 0.51)
  Top 0.203: v27.85,32.54 D6.2
  Bottom 0.203: v27.85,32.54 27.85,33.58 28.41,34.14 R7.1
N$10  (via drill 0.51)
  Top 0.203: v28.44,31.43 27.42,30.41 D6.1
  Bottom 0.203: R8.1 28.44,31.98 v28.44,31.43
N$11
  Bottom 0.203: U1.24 29.05,20.46 29.05,19.64 29.42,19.28 R13.1
ROT1  (via drill 0.51)
  Top 0.406: v20.13,10.73 20.13,10.9 18.55,12.48 18.55,14 17.46,15.09 S4.1
  Bottom 0.203: U1.26 26.13,22.52 25.75,22.89 24.48,22.89 24.17,22.58 24.17,12.58 22.26,10.67 20.22,10.67 20.16,10.73 v20.13,10.73
ROT2  (via drill 0.51)
  Top 0.406: v22.96,13.26 22.87,13.17 22.87,12.29 24.36,10.8 S4.2
  Bottom 0.203: U1.28 26.3,23.52 26.1,23.72 24.14,23.72 23.63,23.21 23.32,22.89 23.32,14.09 23.04,13.82 23.04,13.34 v22.96,13.26
ROT3  (via drill 0.51)
  Top 0.203: v18.75,10.86 18.69,10.8
  Top 0.406: 18.69,10.8 S4.4
  Bottom 0.203: U1.27 26.21,23.02 25.93,23.3 24.31,23.3 23.77,22.76 23.77,12.87 22.44,11.54 19.44,11.54 v18.75,10.86
ROT4  (via drill 0.51)
  Top 0.203: v24.99,15.88 S4.8
  Bottom 0.203: U1.25 26.05,22.02 25.59,22.48 24.65,22.48 24.58,22.41 24.58,16.28 v24.99,15.88
RST  (via drill 0.51)
  Top 0.203: v30.07,31.12 30.07,32.03 28.32,33.79 14.13,33.79 11.86,31.51 11.86,31.22 v11.04,30.4
  Bottom 0.203: U1.40 30.5,29.76 30.48,29.78 30.48,30.72 v30.07,31.12 | 9.58,30.4 X1.5
  Bottom 0.406: 9.58,30.4 v11.04,30.4 11.34,30.71 11.4,30.71 11.95,31.26 11.95,33.27 11.47,33.75 TP3.TP
SCL  (via drill 0.51)
  Top 0.203: LCD2.4 29.44,22.38 v29.44,23.06
  Top 0.406: R1.1 19.18,27.52 19.18,26.08 v17.42,24.32 17.42,22.33 LCD1.4
  Bottom 0.203: U1.32 27.33,25.52 27.38,25.46 | U1.32 27.55,25.46 29.06,25.46 30.3,24.22 30.3,23.92 v29.44,23.06 | U1.32 18.62,25.52 v17.42,24.32
  other vias: 18.71,27.98
SDA  (via drill 0.51)
  Top 0.406: v28.96,24.4 30.55,24.4 31.9,23.06 v32.07,23.06 LCD2.5 | LCD1.5 20,24.02 v20.21,24.23 19.82,24.62 19.82,28.2 19.05,28.97 18.38,28.97 17.87,28.46 17.38,27.97 v16.91,27.97
  Bottom 0.203: R2.1 v16.91,27.97 | v20.21,24.23 21.08,25.1 26.47,25.1 26.56,25.02 U1.31 28.35,25.02 v28.96,24.4
SPK
  Bottom 0.203: SPK1.+ 34,13.91 34,15.29 36.66,17.95 36.66,19.2 36.48,19.38 34.31,19.38 34,19.69 U1.14
SWCLK  (via drill 0.51)
  Top 0.203: v32.14,30.64 28.55,34.24 13.73,34.24 11.12,31.62 v11.02,31.62
  Bottom 0.203: U1.45 32.94,29.07 32.94,29.89 32.77,30.07 32.72,30.07 v32.14,30.64 | v11.02,31.62 10.75,31.34 X1.6
SWDIO  (via drill 0.51)
  Top 0.203: v32.08,31.86 31.6,31.86 28.81,34.65 12.79,34.65 v11.04,32.89
  Bottom 0.203: U1.46 33.44,29.07 33.44,30.49 v32.08,31.86 | v11.04,32.89 11.04,32.74 10.64,32.34 X1.7
VDDCORE
  Bottom 0.203: 32.05,29.07 U1.43 32.05,28.96 32.05,27.2 32.58,26.67 33.48,26.67 34.94,28.14 34.94,30.72 34.1,31.56 C7.1 34.1,32.28
XIN32
  Bottom 0.203: C1.2 36.63,32.05 Y1.P$2 36.63,28.15 U1.1
XOUT32
  Bottom 0.203: C2.2 39.77,30.85 Y1.P$1 | U1.2 36.05,27.07 36.88,27.07 37.1,27.29 37.1,28.52 38.41,29.83 39.43,29.83 Y1.P$1 | Y1.P$1 39.8,30.13
(copper drawn outside any net)
  shapes: Bottom area x9961, Top area x7499

### Text on the board
tPlace: 1234 | 5678